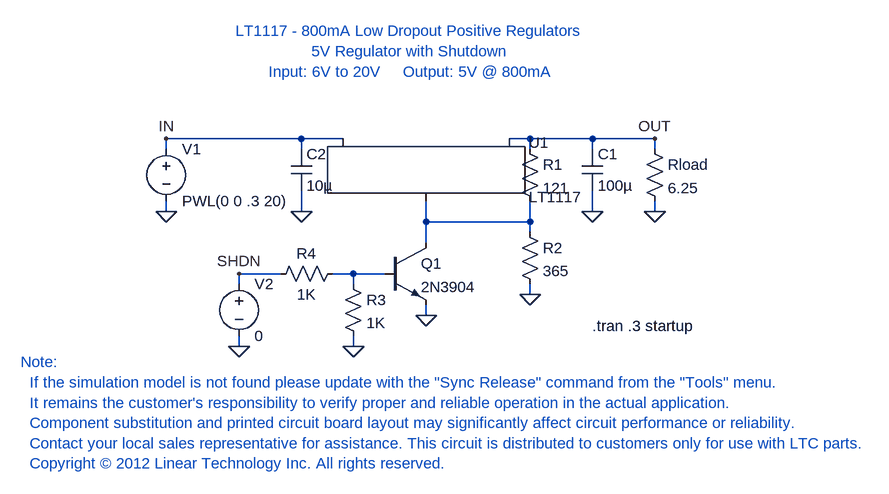
[diagram p0: schematic LT1117_TA04.asc]
LT1117_TA04.asc, the LTspice schematic file:
Version 4
SHEET 1 1272 684
WIRE 16 160 -192 160
WIRE 80 160 16 160
WIRE 368 160 336 160
WIRE 464 160 368 160
WIRE 560 160 464 160
WIRE -192 176 -192 160
WIRE 16 176 16 160
WIRE 368 176 368 160
WIRE 464 176 464 160
WIRE 560 176 560 160
WIRE -192 272 -192 256
WIRE 16 272 16 240
WIRE 464 272 464 240
WIRE 560 272 560 256
WIRE 208 288 208 256
WIRE 368 288 368 256
WIRE 368 288 208 288
WIRE 368 304 368 288
WIRE 208 320 208 288
WIRE -16 368 -80 368
WIRE 96 368 64 368
WIRE 144 368 96 368
WIRE -80 384 -80 368
WIRE 96 384 96 368
WIRE 368 400 368 384
WIRE 208 432 208 416
WIRE -80 480 -80 464
WIRE 96 480 96 464
FLAG 16 272 0
FLAG -192 272 0
FLAG 96 480 0
FLAG 208 432 0
FLAG -192 160 IN
FLAG 368 400 0
FLAG 560 272 0
FLAG 464 272 0
FLAG -80 480 0
FLAG 560 160 OUT
FLAG -80 368 SHDN
SYMBOL PowerProducts\\LT1117 208 160 R0
SYMATTR InstName U1
SYMBOL res 352 160 R0
SYMATTR InstName R1
SYMATTR Value 121
SYMBOL res 352 288 R0
SYMATTR InstName R2
SYMATTR Value 365
SYMBOL cap 448 176 R0
SYMATTR InstName C1
SYMATTR Value 100µ
SYMATTR SpiceLine Rser=10m
SYMBOL cap 0 176 R0
SYMATTR InstName C2
SYMATTR Value 10µ
SYMBOL npn 144 320 R0
SYMATTR InstName Q1
SYMATTR Value 2N3904
SYMBOL res 80 368 R0
SYMATTR InstName R3
SYMATTR Value 1K
SYMBOL res 80 352 R90
WINDOW 0 0 56 VBottom 2
WINDOW 3 32 56 VTop 2
SYMATTR InstName R4
SYMATTR Value 1K
SYMBOL voltage -192 160 R0
WINDOW 123 0 0 Left 2
WINDOW 39 0 0 Left 2
SYMATTR InstName V1
SYMATTR Value PWL(0 0 .3 20)
SYMBOL voltage -80 368 R0
WINDOW 123 24 138 Left 2
WINDOW 39 24 117 Left 2
SYMATTR InstName V2
SYMATTR Value 0
SYMBOL res 544 160 R0
SYMATTR InstName Rload
SYMATTR Value 6.25
TEXT 464 448 Left 2 !.tran .3 startup
TEXT 184 72 Bottom 2 ;LT1117 - 800mA Low Dropout Positive Regulators\n5V Regulator with Shutdown\nInput: 6V to 20V     Output: 5V @ 800mA
TEXT -416 504 Left 2 ;Note:\n  If the simulation model is not found please update with the "Sync Release" command from the "Tools" menu.\n  It remains the customer's responsibility to verify proper and reliable operation in the actual application.\n  Component substitution and printed circuit board layout may significantly affect circuit performance or reliability.\n  Contact your local sales representative for assistance. This circuit is distributed to customers only for use with LTC parts.\n  Copyright © 2012 Linear Technology Inc. All rights reserved.

The netlist it stands for:
* LT1117_TA04.asc
XU1 N001 OUT IN LT1117
R1 OUT N001 121
R2 N001 0 365
C1 OUT 0 100µ Rser=10m
C2 IN 0 10µ
Q1 N001 N002 0 0 2N3904
R3 N002 0 1K
R4 N002 SHDN 1K
V1 IN 0 PWL(0 0 .3 20)
V2 SHDN 0 0
Rload OUT 0 6.25
.model NPN NPN
.model PNP PNP
.lib standard.bjt
.tran .3 startup
* LT1117 - 800mA Low Dropout Positive Regulators
* 5V Regulator with Shutdown
* Input: 6V to 20V     Output: 5V @ 800mA
* Note:
*   If the simulation model is not found please update with the "Sync Release" command from the "Tools" menu.
*   It remains the customer's responsibility to verify proper and reliable operation in the actual application.
*   Component substitution and printed circuit board layout may significantly affect circuit performance or reliability.
*   Contact your local sales representative for assistance. This circuit is distributed to customers only for use with LTC parts.
*   Copyright © 2012 Linear Technology Inc. All rights reserved.
.lib LT1117.lib
.backanno
.end